# EasyEDA schematic Fan testing rig, github.json

## Sheets
1 main unit: TITLE: Sheet_1; REV: 1.0; Date: 2021-09-24; Sheet: 1/1; Company: Your Company
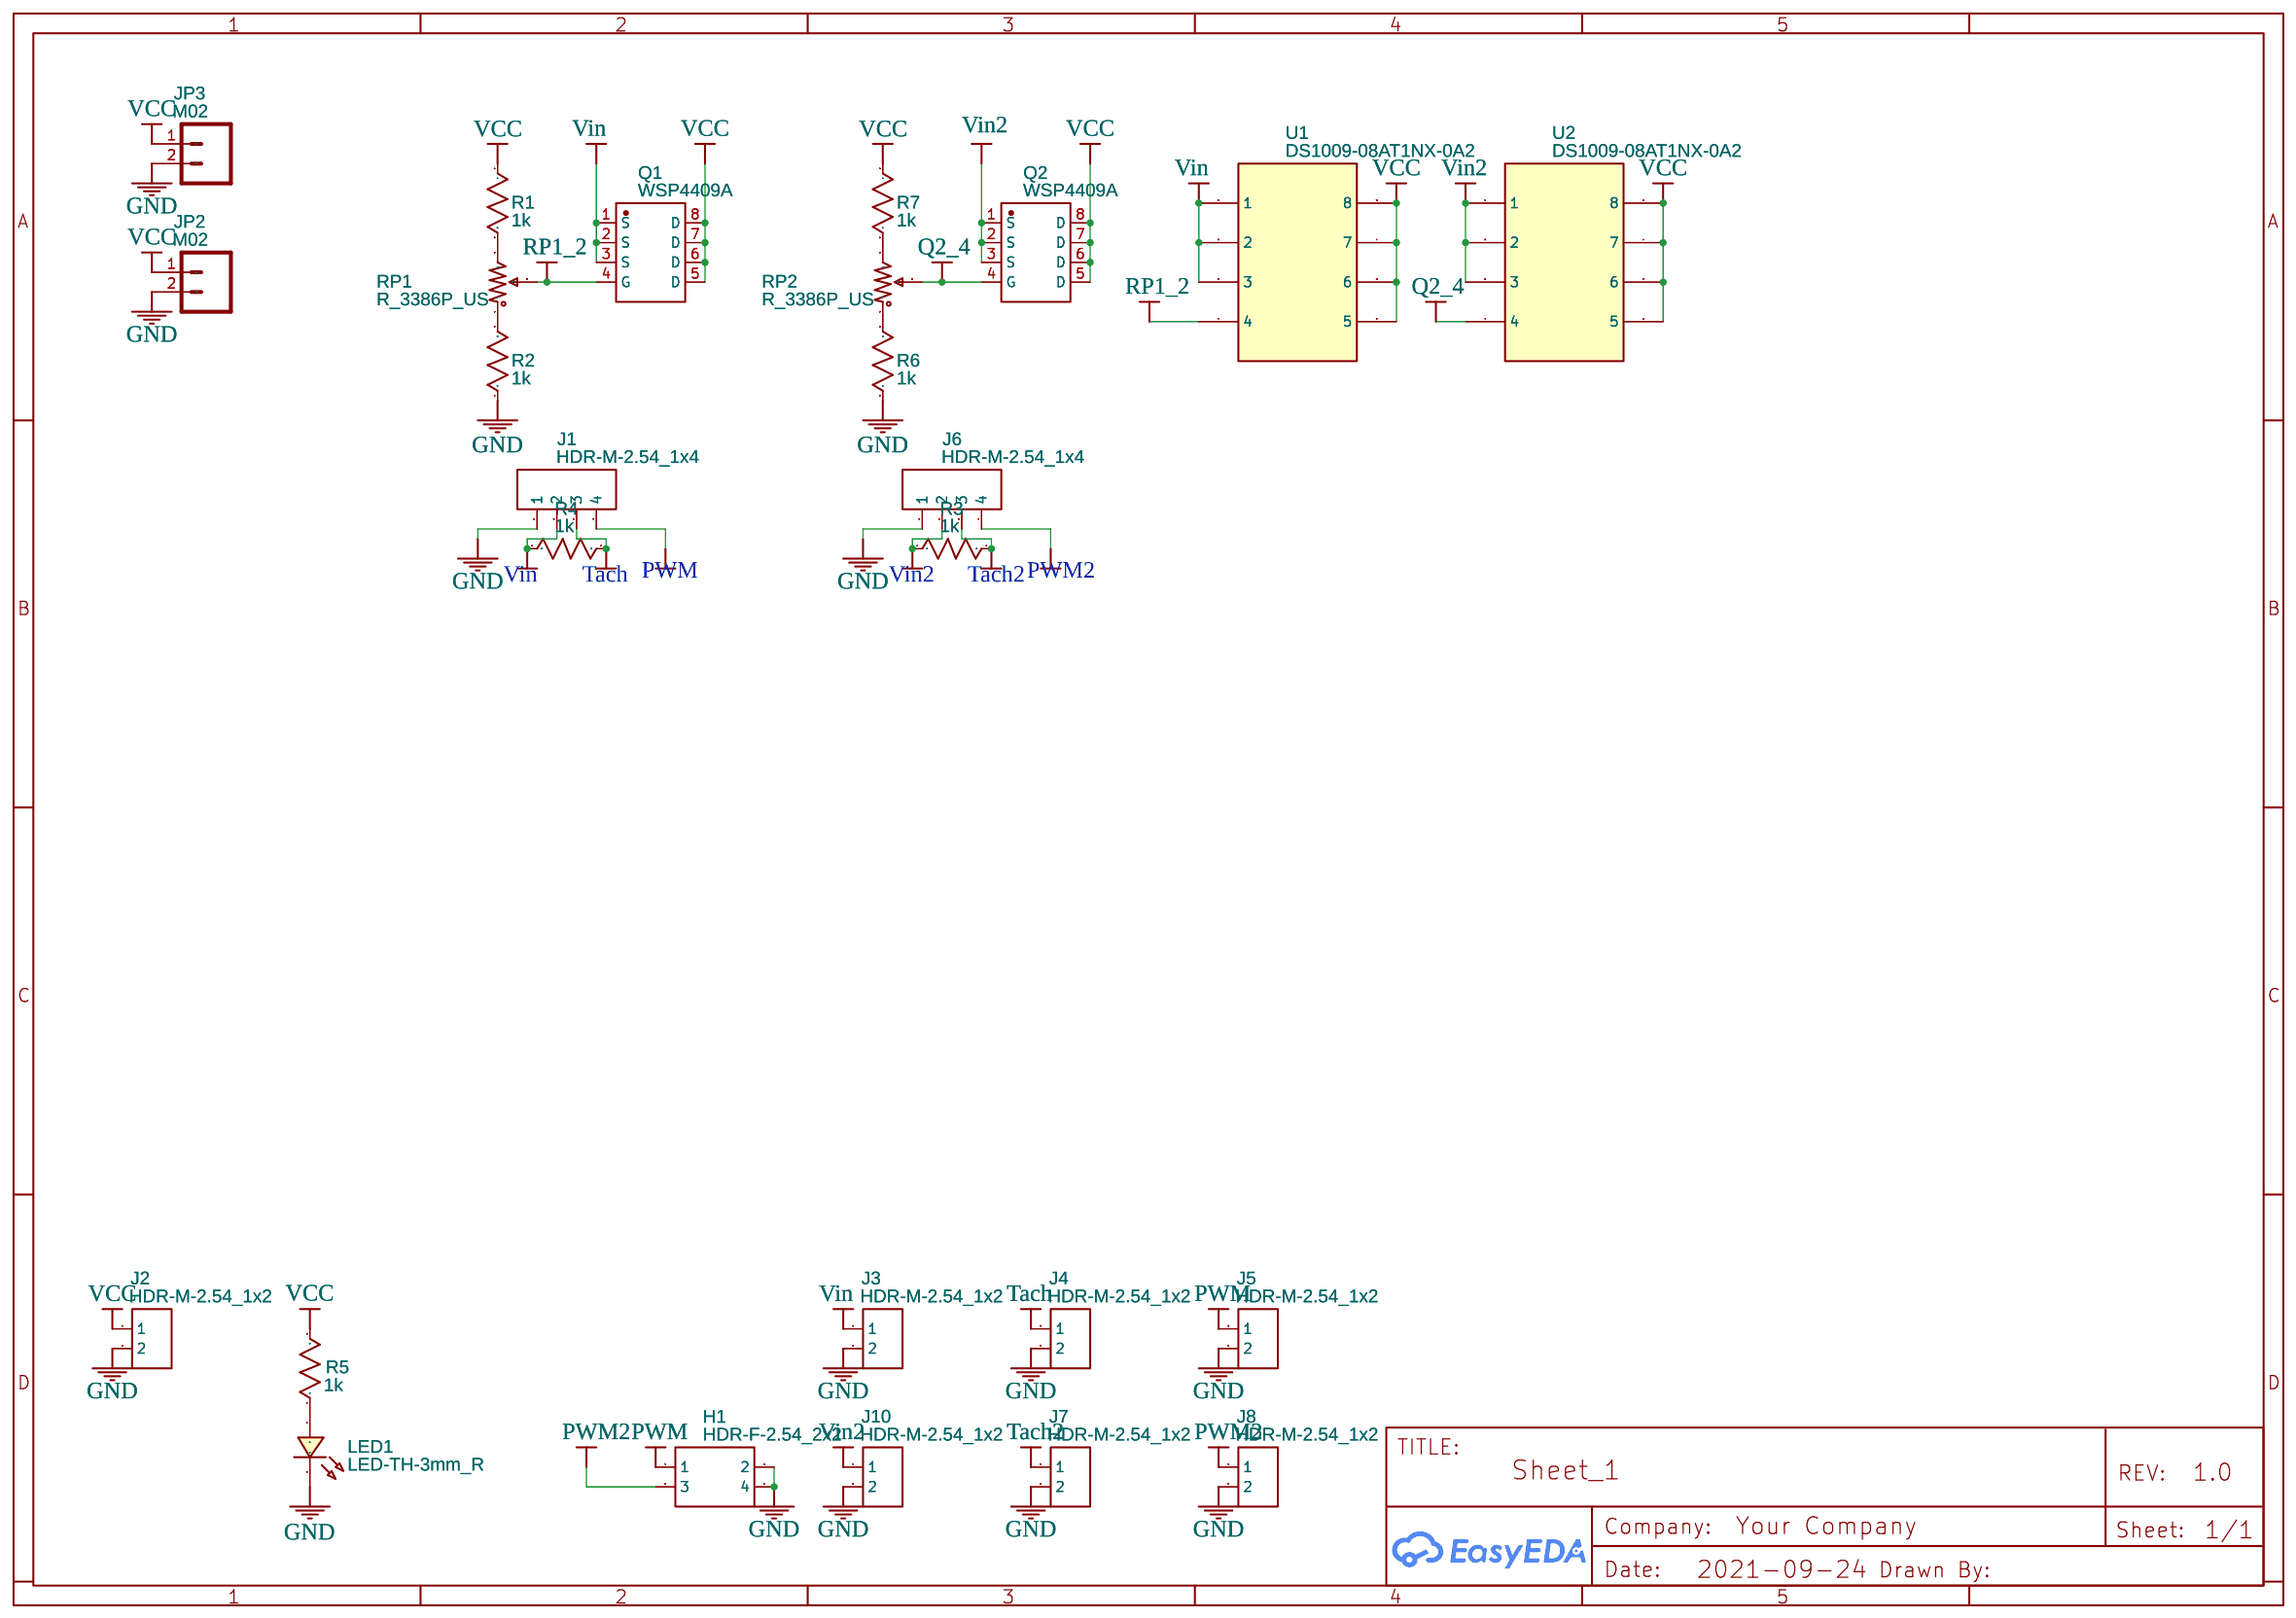
[diagram p0: main unit]
2 PWM controll: TITLE: Sheet_2; Date: 2021-09-27
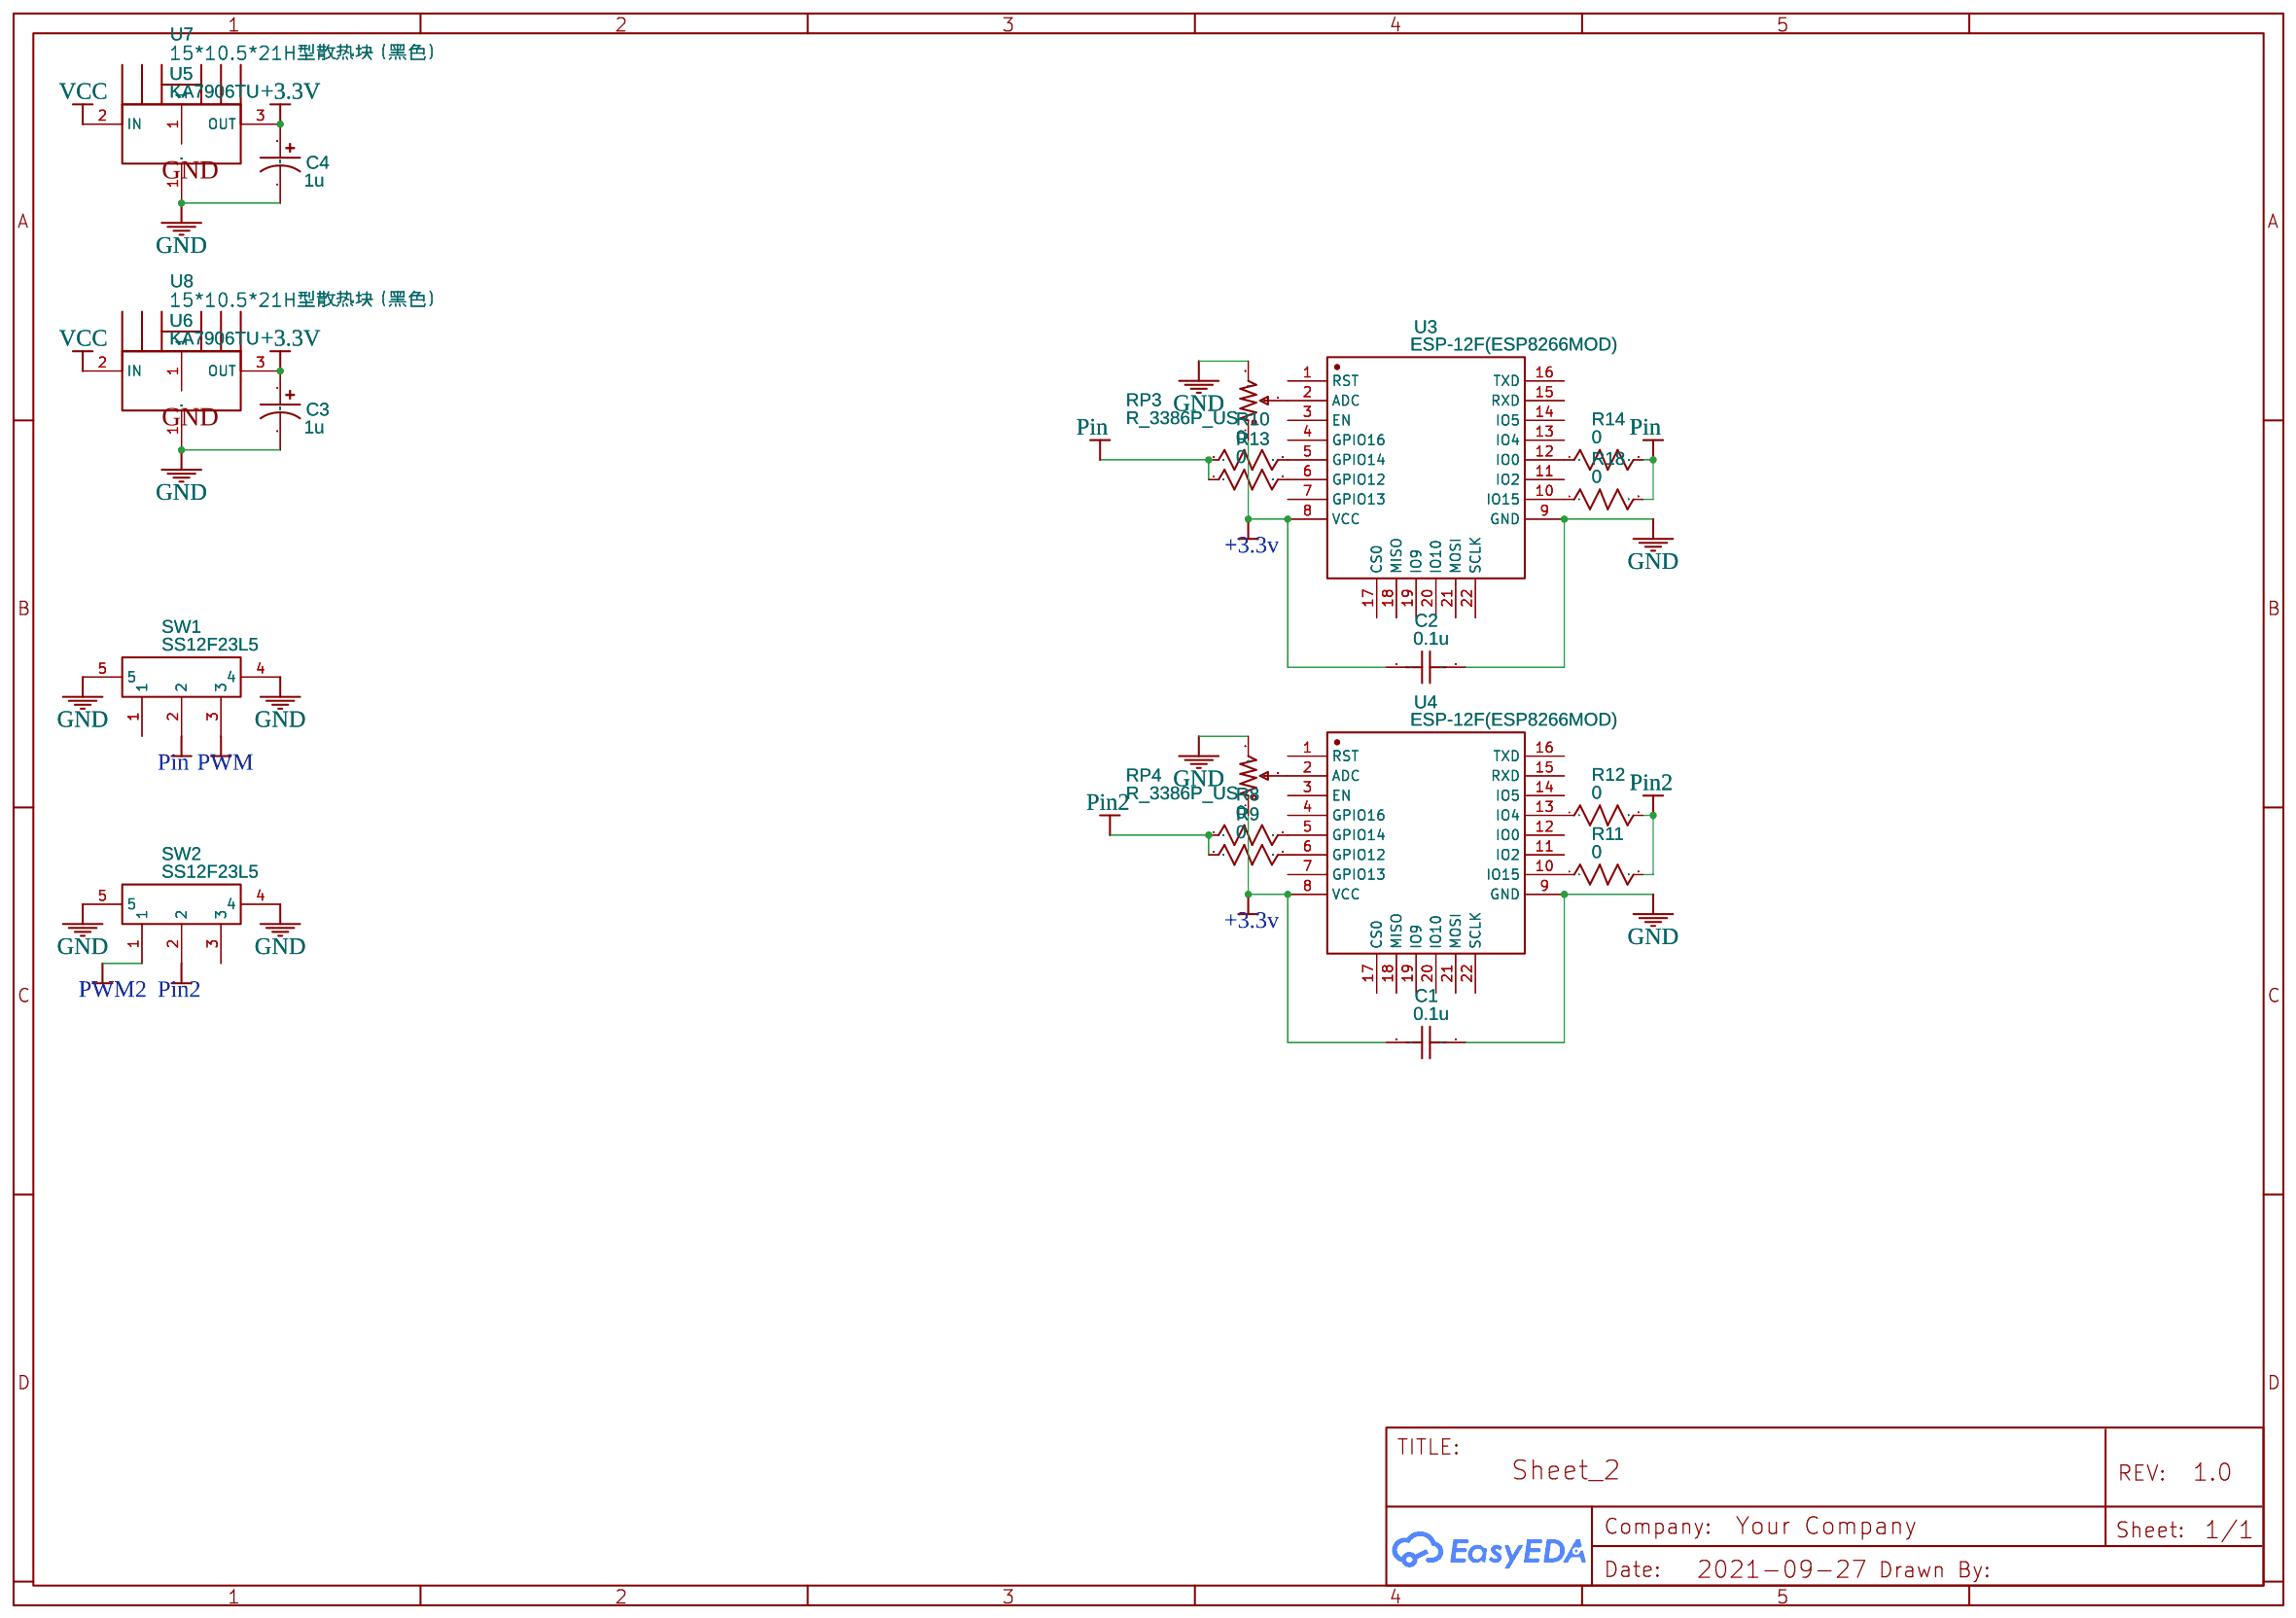
[diagram p1: PWM controll]

## Parts
sheet main unit
H1  HDR-F-2.54_2x2  [HDR-F-2.54_2X2]
J1  HDR-M-2.54_1x4  [HDR-M-2.54_1X4]
J2  HDR-M-2.54_1x2  [HDR-M-2.54_1X2]
J3  HDR-M-2.54_1x2  [HDR-M-2.54_1X2]
J4  HDR-M-2.54_1x2  [HDR-M-2.54_1X2]
J5  HDR-M-2.54_1x2  [HDR-M-2.54_1X2]
J6  HDR-M-2.54_1x4  [HDR-M-2.54_1X4]
J7  HDR-M-2.54_1x2  [HDR-M-2.54_1X2]
J8  HDR-M-2.54_1x2  [HDR-M-2.54_1X2]
J10  HDR-M-2.54_1x2  [HDR-M-2.54_1X2]
JP2  M02  [SCREWTERMINAL-5MM-2]
JP3  M02  [SCREWTERMINAL-5MM-2]
LED1  LED-TH-3mm_R  [LED-TH_BD3.0_RED]
Q1  WSP4409A  [SOP-8_L4.9-W3.9-P1.27-LS6.0-BL]
Q2  WSP4409A  [SOP-8_L4.9-W3.9-P1.27-LS6.0-BL]
R1  1k  [R_AXIAL-0.3]
R2  1k  [R_AXIAL-0.3]
R3  1k  [R_AXIAL-0.3]
R4  1k  [R_AXIAL-0.3]
R5  1k  [R_AXIAL-0.3]
R6  1k  [R_AXIAL-0.3]
R7  1k  [R_AXIAL-0.3]
RP1  R_3386P_US  [RES-ADJ-TH_3386P]
RP2  R_3386P_US  [RES-ADJ-TH_3386P]
U1  DS1009-08AT1NX-0A2  [DIP-8_L10.0-W6.5-P2.54-LS7.6-BL]
U2  DS1009-08AT1NX-0A2  [DIP-8_L10.0-W6.5-P2.54-LS7.6-BL]
sheet PWM controll
C1  0.1u  [C0805]
C2  0.1u  [C0805]
C3  1u  [CAP-D8.0×F3.5]
C4  1u  [CAP-D8.0×F3.5]
R8  0  [R_AXIAL-0.3]
R9  0  [R_AXIAL-0.3]
R10  0  [R_AXIAL-0.3]
R11  0  [R_AXIAL-0.3]
R12  0  [R_AXIAL-0.3]
R13  0  [R_AXIAL-0.3]
R14  0  [R_AXIAL-0.3]
R18  0  [R_AXIAL-0.3]
RP3  R_3386P_US  [RES-ADJ-TH_3386P]
RP4  R_3386P_US  [RES-ADJ-TH_3386P]
SW1  SS12F23L5  [SW-TH_XKBCONNECTIVITY_SS12F23L5]
SW2  SS12F23L5  [SW-TH_XKBCONNECTIVITY_SS12F23L5]
U3  ESP-12F(ESP8266MOD)  [WIFIM-SMD_ESP-12F-ESP8266MOD]
U4  ESP-12F(ESP8266MOD)  [WIFIM-SMD_ESP-12F-ESP8266MOD]
U5  KA7906TU  [TO-220-3_L10.0-W4.5-P2.54-T]
U6  KA7906TU  [TO-220-3_L10.0-W4.5-P2.54-T]
U7  15*10.5*21H型散热块（黑色）  [HEATSINK-TH_L15.5-W10.5-XSD1226-005]
U8  15*10.5*21H型散热块（黑色）  [HEATSINK-TH_L15.5-W10.5-XSD1226-005]

## Library data of the parts
H1 = HDR-F-2.54_2x2: Supplier Part: C239342; Supplier: LCSC; Contributor: LCEDA_Lib
J1 J6 = HDR-M-2.54_1x4: Supplier Part: C124378; Supplier: LCSC; Contributor: LCEDA_Lib
J2-J5 J7 J8 J10 = HDR-M-2.54_1x2: Supplier Part: C124375; Supplier: LCSC; Contributor: LCEDA_Lib
JP2 JP3 = M02: Contributor: SparkFun
LED1 = LED-TH-3mm_R: Manufacturer: EVERLIGHT(台湾亿光); Manufacturer Part: 204-10SDRD/S530-A3-L; Supplier Part: C84774; Supplier: LCSC; Contributor: LCEDA_Lib
Q1 Q2 = WSP4409A: Supplier: LCSC; Supplier Part: C2880527; Manufacturer: WINSOK微硕; Contributor: LCSC
R1-R14 R18 = R_AXIAL-0.3_US: Contributor: LCEDA_Lib
RP1-RP4 = R_3386P_US: Supplier: LCSC; Contributor: LCEDA_Lib; value(Ω): 10K
U1 U2 = DS1009-08AT1NX-0A2: Supplier: LCSC; Manufacturer: CONNFLY; Supplier Part: C72124; JLCPCB Part Class: Extended Part
C1 C2 = C_0805_US: Contributor: LCEDA_Lib
C3 C4 = CE_TH_D8.0×F3.5_US: Contributor: LCEDA_Lib
SW1 SW2 = SS12F23L5: Supplier: LCSC; Supplier Part: C2884749; Manufacturer: XKB Connectivity(中国星坤); Contributor: LCSC
U3 U4 = ESP-12F(ESP8266MOD): Supplier: LCSC; Manufacturer: Ai-Thinker; Supplier Part: C82891; JLCPCB Part Class: Extended Part
U5 U6 = KA7906TU: Supplier: LCSC; Manufacturer: FAIRCHILD; Supplier Part: C112610
U7 U8 = 15*10.5*21H型散热块（黑色）: Supplier: LCSC; Supplier Part: C116600; Manufacturer: XSD(鑫顺达); JLCPCB Part Class: Extended Part; Contributor: LCSC

## Nets
+3.3v: C1.1 C2.1 RP3.1 RP4.1 U3.8(VCC) U4.8(VCC)
+3.3V: C3.1 C4.1 U5.3(OUT) U6.3(OUT)
GND: C1.2 C2.2 C3.2 C4.2 H1.2 H1.4 J1.1 J2.2 J3.2 J4.2 J5.2 J6.1 J7.2 J8.2 J10.2 JP2.2 JP3.2 LED1.2 R2.1 R6.1 RP3.3 RP4.3 SW1.4 SW1.5 SW2.4 SW2.5 U3.9(GND) U4.9(GND) U5.1(GND) U6.1(GND)
VCC: J2.1 JP2.1 JP3.1 Q1.5(D) Q1.6(D) Q1.7(D) Q1.8(D) Q2.5(D) Q2.6(D) Q2.7(D) Q2.8(D) R1.1 R5.2 R7.1 U1.5 U1.6 U1.7 U1.8 U2.5 U2.6 U2.7 U2.8 U5.2(IN) U6.2(IN)
Vin: J1.2 J3.1 Q1.1(S) Q1.2(S) Q1.3(S) R4.1 U1.1 U1.2 U1.3
Vin2: J6.2 J10.1 Q2.1(S) Q2.2(S) Q2.3(S) R3.1 U2.1 U2.2 U2.3
Pin: R10.1 R13.1 R14.2 R18.2 SW1.2
Pin2: R8.1 R9.1 R11.2 R12.2 SW2.2
PWM: H1.1 J1.4 J5.1 SW1.3
PWM2: H1.3 J6.4 J8.1 SW2.1
Q2_4: Q2.4(G) RP2.2 U2.4
RP1_2: Q1.4(G) RP1.2 U1.4
Tach: J1.3 J4.1 R4.2
Tach2: J6.3 J7.1 R3.2
Net-(LED1-1): LED1.1 R5.1
Net-(R1-2): R1.2 RP1.3
Net-(R2-2): R2.2 RP1.1
Net-(R6-2): R6.2 RP2.1
Net-(R7-2): R7.2 RP2.3
Net-(R8-2): R8.2 U4.5(GPIO14)
Net-(R9-2): R9.2 U4.6(GPIO12)
Net-(R10-2): R10.2 U3.5(GPIO14)
Net-(R11-1): R11.1 U4.10(IO15)
Net-(R12-1): R12.1 U4.13(IO4)
Net-(R13-2): R13.2 U3.6(GPIO12)
Net-(R14-1): R14.1 U3.12(IO0)
Net-(R18-1): R18.1 U3.10(IO15)
Net-(RP3-2): RP3.2 U3.2(ADC)
Net-(RP4-2): RP4.2 U4.2(ADC)

Not connected (* = marked no-connect by the designer): SW1 1; SW2 3; U3 1(RST) 3(EN) 4(GPIO16) 7(GPIO13) 11(IO2) 13(IO4) 14(IO5) 15(RXD) 16(TXD) 17(CS0) 18(MISO) 19(IO9) 20(IO10) 21(MOSI) 22(SCLK); U4 1(RST) 3(EN) 4(GPIO16) 7(GPIO13) 11(IO2) 12(IO0) 14(IO5) 15(RXD) 16(TXD) 17(CS0) 18(MISO) 19(IO9) 20(IO10) 21(MOSI) 22(SCLK); U7 1; U8 1
